# EAGLE design pcb (EAGLE 9.5.2)
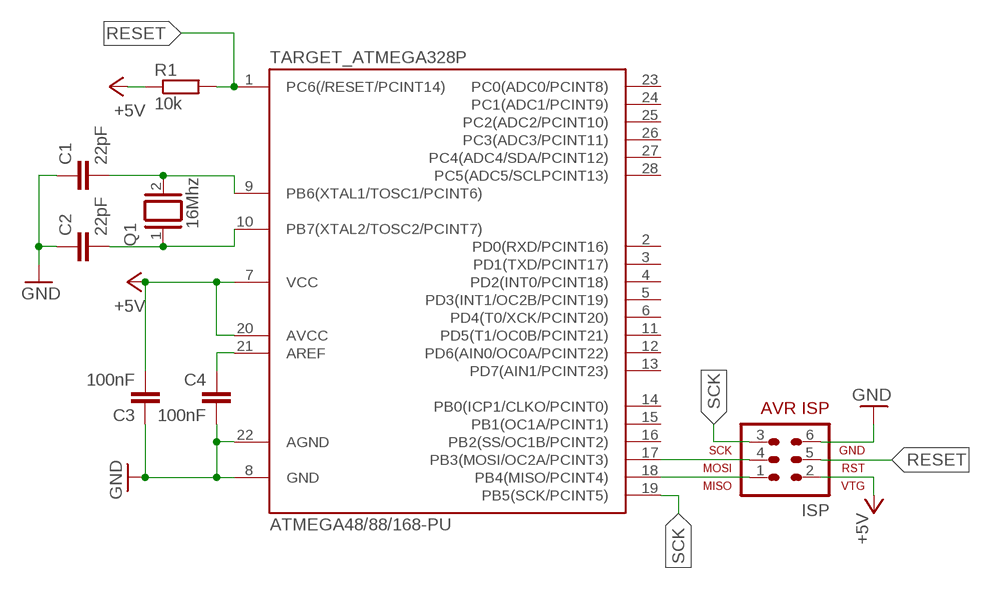
[diagram p0: schematic, sheet 1]

## Parts
C1  22pF  C-EUC0805  [C0805]
C2  22pF  C-EUC0805  [C0805]
C3  100nF  C-EUC0805  [C0805]
C4  100nF  C-EUC0805  [C0805]
ISP  AVR-ISP-6  [AVR-ISP-6]
Q1  16Mhz  XTAL/S  [QS]
R1  10k  R-EU_R0805  [R0805]
TARGET_ATMEGA328P  ATMEGA48/88/168-PU  [DIL28-3]

## Nets
+5V [power]: C3.2 ISP.2 R1.1 TARGET_ATMEGA328P.7(VCC) TARGET_ATMEGA328P.20(AVCC)
GND [power]: C1.1 C2.1 C3.1 C4.2 ISP.6 TARGET_ATMEGA328P.8(GND) TARGET_ATMEGA328P.22(AGND)
N$1: ISP.4 TARGET_ATMEGA328P.17(PB3(MOSI/OC2A/PCINT3))
N$2: ISP.1 TARGET_ATMEGA328P.18(PB4(MISO/PCINT4))
N$7: C1.2 Q1.2 TARGET_ATMEGA328P.9(PB6(XTAL1/TOSC1/PCINT6))
N$8: C2.2 Q1.1 TARGET_ATMEGA328P.10(PB7(XTAL2/TOSC2/PCINT7))
N$22: C4.1 TARGET_ATMEGA328P.21(AREF)
RESET: ISP.5 R1.2 TARGET_ATMEGA328P.1(PC6(/RESET/PCINT14))
SCK: ISP.3 TARGET_ATMEGA328P.19(PB5(SCK/PCINT5))
Unconnected: TARGET_ATMEGA328P.2(PD0(RXD/PCINT16)) TARGET_ATMEGA328P.3(PD1(TXD/PCINT17)) TARGET_ATMEGA328P.4(PD2(INT0/PCINT18)) TARGET_ATMEGA328P.5(PD3(INT1/OC2B/PCINT19)) TARGET_ATMEGA328P.6(PD4(T0/XCK/PCINT20)) TARGET_ATMEGA328P.11(PD5(T1/OC0B/PCINT21)) TARGET_ATMEGA328P.12(PD6(AIN0/OC0A/PCINT22)) TARGET_ATMEGA328P.13(PD7(AIN1/PCINT23)) TARGET_ATMEGA328P.14(PB0(ICP1/CLKO/PCINT0)) TARGET_ATMEGA328P.15(PB1(OC1A/PCINT1)) TARGET_ATMEGA328P.16(PB2(SS/OC1B/PCINT2)) TARGET_ATMEGA328P.23(PC0(ADC0/PCINT8)) TARGET_ATMEGA328P.24(PC1(ADC1/PCINT9)) TARGET_ATMEGA328P.25(PC2(ADC2/PCINT10)) TARGET_ATMEGA328P.26(PC3(ADC3/PCINT11)) TARGET_ATMEGA328P.27(PC4(ADC4/SDA/PCINT12)) TARGET_ATMEGA328P.28(PC5(ADC5/SCLPCINT13))

## Library data of the parts
C1-C4 = rcl:C-EU: CAPACITOR, European symbol; SPICEPREFIX: C
ISP = atmel:AVR-ISP-6: AVR ISP-6 Serial Programming Header
Q1 = special:XTAL/S: CRYSTAL
R1 = rcl:R-EU_: RESISTOR, European symbol; SPICEPREFIX: R
TARGET_ATMEGA328P = atmega8:ATMEGA48/88/168-PU

## Net classes
0 default: width 0.508 mm
1 power: width 0.508 mm

## Board
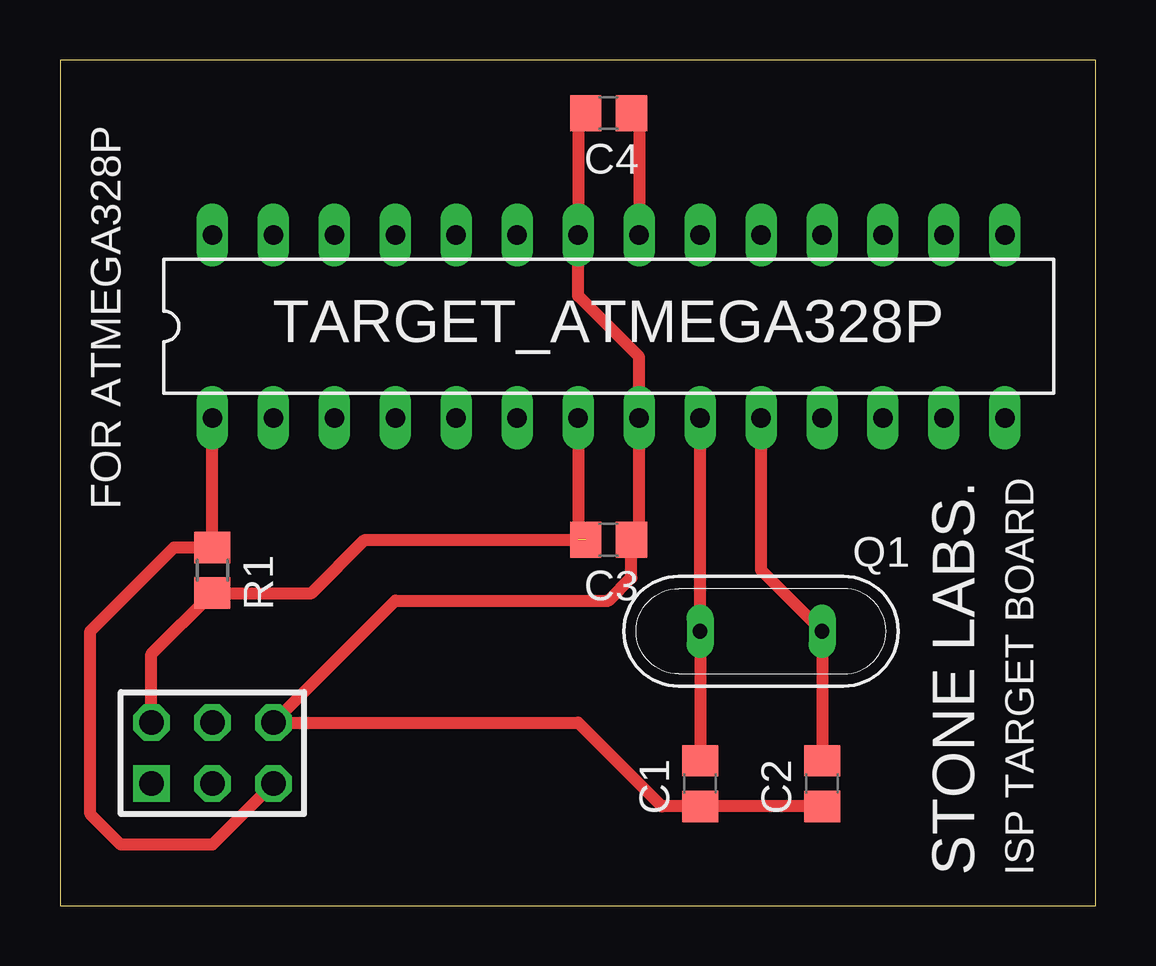
[diagram p1: board, top side]
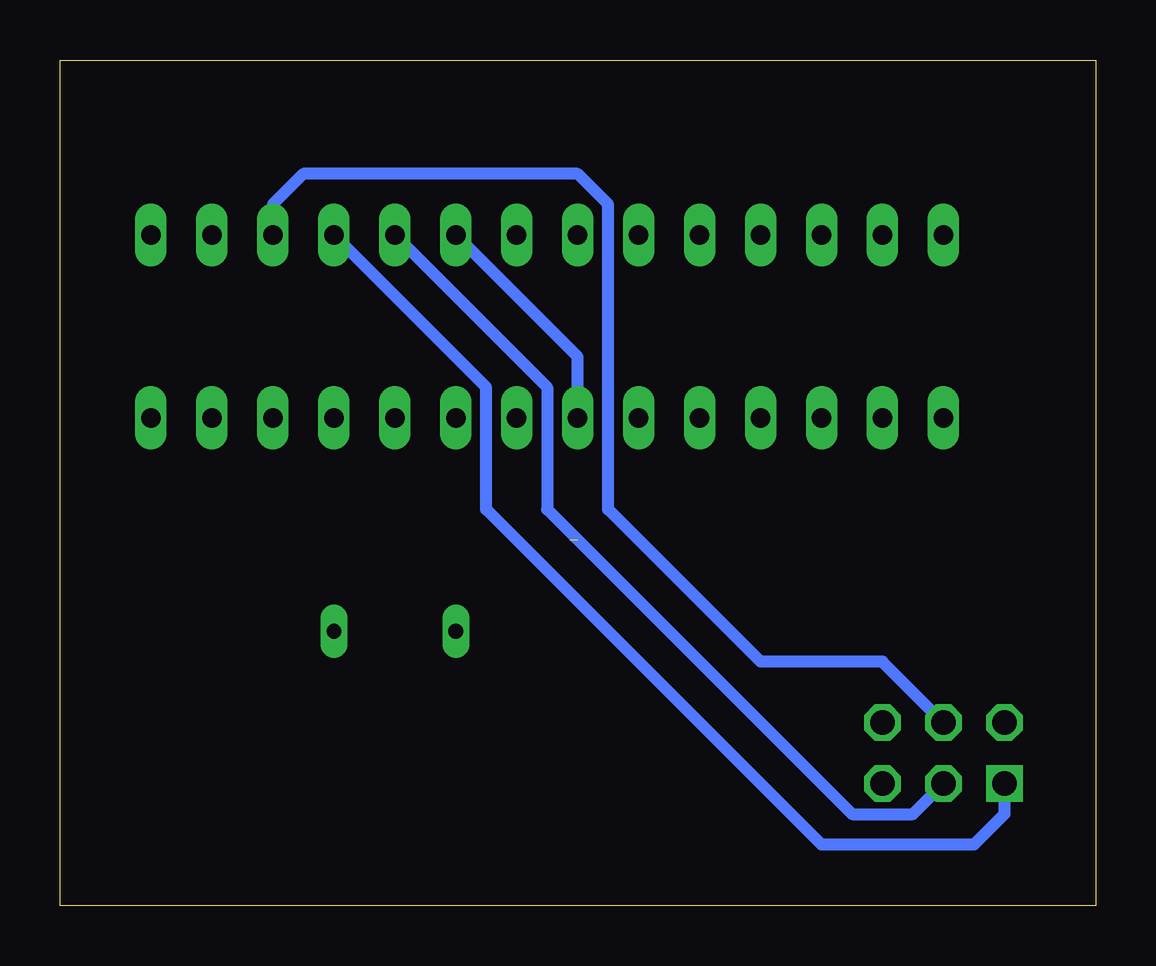
[diagram p2: board, bottom side, seen from below]

Size 43.16 x 35.23 mm. Coordinates in mm from the lower left corner, seen from the top.
Outline: 0,0 43.16,0 43.16,35.23 0,35.23 0,0
Copper layers (1*16): Top 0.035mm / dielectric 1.5mm / Bottom 0.035mm
Design rules "default": minimum track width 6mil, minimum drill 0.35mm, track to track 6mil, track to pad 6mil, pad to pad 6mil, via to via 6mil, smd to smd 6mil, copper to edge 40mil, drill to drill 6mil, minimum pad ring 10mil, minimum via ring 8mil, stop-mask expansion 4mil, vias tented up to drill 0mil, thermal gap 10mil

### Footprints (pad centres in the part's own frame; a part is rotated, then mirrored left to right if it is on the bottom)
C0805 = smd 1.3 x 1.5: 1 -0.95,0; 2 0.95,0
AVR-ISP-6 = drill 1.016 square: 1 -2.54,-1.27 | drill 1.016 octagon: 2 -2.54,1.27; 3 0,-1.27; 4 0,1.27; 5 2.54,-1.27; 6 2.54,1.27
QS = drill 0.61 long: 1 -2.54,0; 2 2.54,0
R0805 = smd 1.3 x 1.5: 1 -0.95,0; 2 0.95,0
DIL28-3 = drill 0.813 long: 1 -16.51,-3.81; 2 -13.97,-3.81; 3 -11.43,-3.81; 4 -8.89,-3.81; 5 -6.35,-3.81; 6 -3.81,-3.81; 7 -1.27,-3.81; 8 1.27,-3.81; 9 3.81,-3.81; 10 6.35,-3.81; 11 8.89,-3.81; 12 11.43,-3.81; 13 13.97,-3.81; 14 16.51,-3.81; 15 16.51,3.81; 16 13.97,3.81; 17 11.43,3.81; 18 8.89,3.81; 19 6.35,3.81; 20 3.81,3.81; 21 1.27,3.81; 22 -1.27,3.81; 23 -3.81,3.81; 24 -6.35,3.81; 25 -8.89,3.81; 26 -11.43,3.81; 27 -13.97,3.81; 28 -16.51,3.81

### Placement (x,y rotation side)
C1  26.67,5.08 90 top
C2  31.75,5.08 90 top
C3  22.86,15.24 180 top
C4  22.86,33.02 180 top
ISP  6.35,6.35 0 top
Q1  29.21,11.43 180 top
R1  6.35,13.97 90 top
TARGET_ATMEGA328P  22.86,24.13 0 top

### Tracks (layer width: path | path; a pad name or v marks a point on that pad's centre or on a via)
+5V  (1 unrouted)
  Top 0.508: TARGET_ATMEGA328P.7 21.59,15.24 | ISP.2 3.81,10.48 R1.1 10.48,13.02 12.7,15.24 C3.2
  Bottom 0.508: TARGET_ATMEGA328P.7 21.59,22.86 TARGET_ATMEGA328P.20
GND
  Top 0.508: C4.2 21.59,32.7 TARGET_ATMEGA328P.22 21.59,25.4 24.13,22.86 TARGET_ATMEGA328P.8 24.13,15.56 C3.1 23.81,13.65 22.86,12.7 13.97,12.7 ISP.6 21.59,7.62 25.08,4.13 C1.1 | C2.1 C1.1 | C1.1 26.35,3.81
N$1
  Bottom 0.508: ISP.4 8.89,10.16 13.97,10.16 20.32,16.51 20.32,29.21 21.59,30.48 33.02,30.48 34.29,29.21 TARGET_ATMEGA328P.17
N$2
  Bottom 0.508: ISP.1 3.81,3.81 5.08,2.54 11.43,2.54 25.4,16.51 25.4,21.59 TARGET_ATMEGA328P.18
N$7
  Top 0.508: TARGET_ATMEGA328P.9 Q1.2 C1.2
N$8
  Top 0.508: TARGET_ATMEGA328P.10 29.21,13.97 Q1.1 C2.2
N$22
  Top 0.508: C4.1 24.13,32.7 TARGET_ATMEGA328P.21
RESET
  Top 0.508: TARGET_ATMEGA328P.1 R1.2 4.76,14.92 1.27,11.43 1.27,3.81 2.54,2.54 6.35,2.54 ISP.5
SCK
  Bottom 0.508: TARGET_ATMEGA328P.19 22.86,21.59 22.86,16.51 10.16,3.81 7.62,3.81 ISP.3

### Text on the board
tNames: FOR ATMEGA328P | STONE LABS. | ISP TARGET BOARD